# EAGLE schematic Xbee_Adapter (EAGLE 7.5.0)
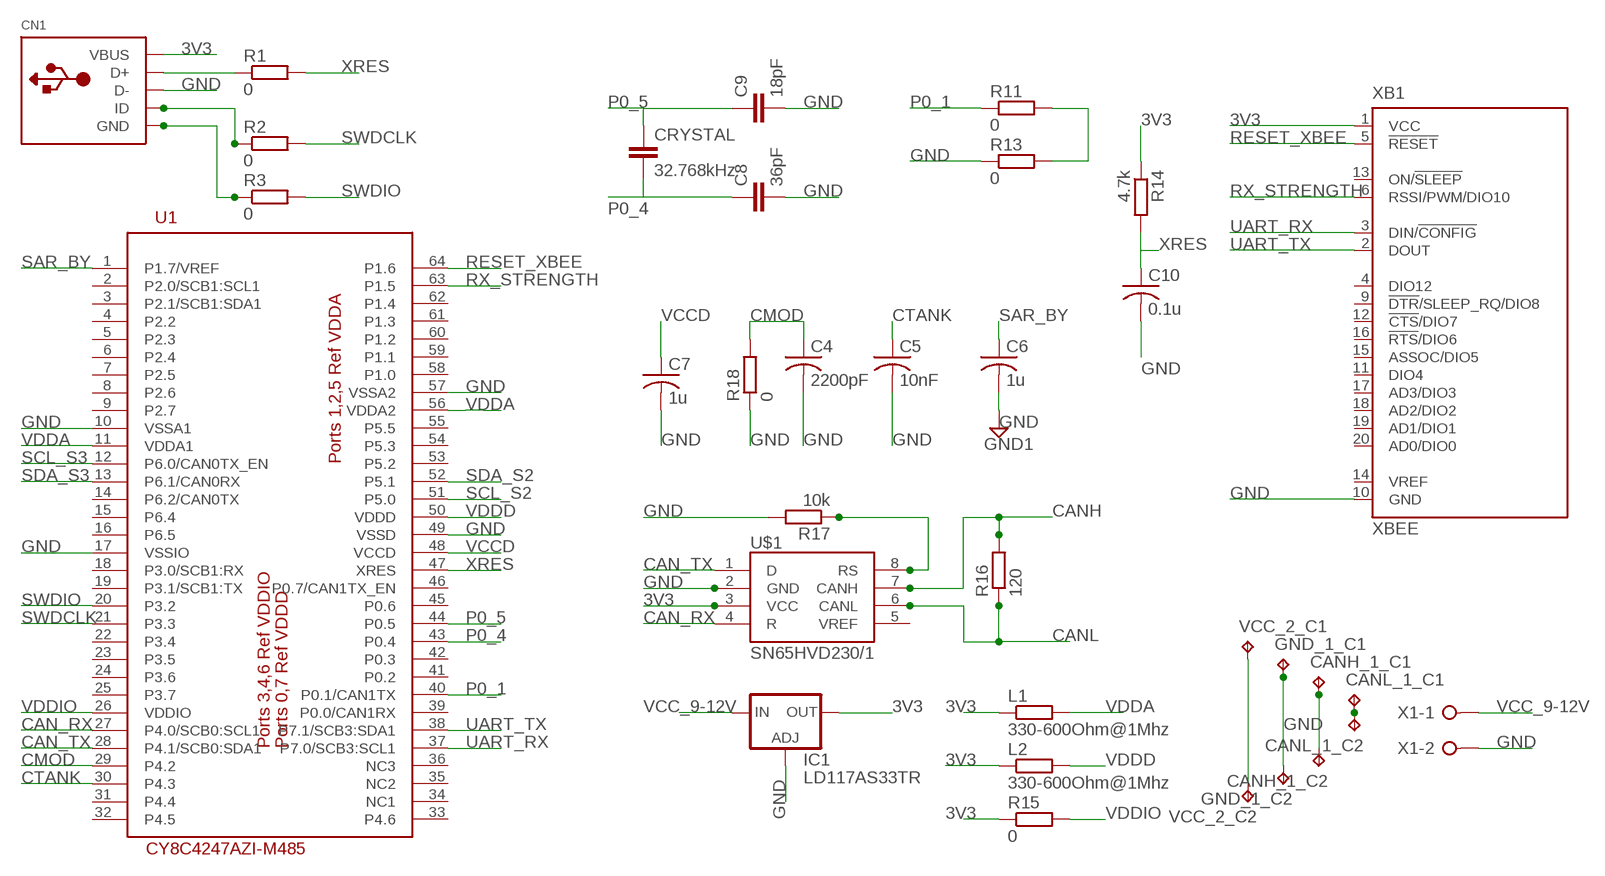
[diagram p0: schematic, sheet 1]

## Parts
C4  2200pF  C-USC0805  [C0805]
C5  10nF  C-USC0805  [C0805]
C6  1u  C-USC0805  [C0805]
C7  1u  C-USC0805  [C0805]
C8  36pF  C-EUC0805  [C0805]
C9  18pF  C-EUC0805  [C0805]
C10  0.1u  C-USC0805  [C0805]
CANH_1_C1  TPB2,54  [B2,54]
CANH_1_C2  TPB2,54  [B2,54]
CANL_1_C1  TPB2,54  [B2,54]
CANL_1_C2  TPB2,54  [B2,54]
CN1  USBMINIB  [USB-MINIB]
CRYSTAL  32.768kHz  C-EUC0603  [C0603]
GND_1_C1  TPB2,54  [B2,54]
GND_1_C2  TPB2,54  [B2,54]
IC1  LD117AS33TR  [SOT223]
L1  330-600Ohm@1Mhz  R-EU_R0805  [R0805]
L2  330-600Ohm@1Mhz  R-EU_R0805  [R0805]
R1  0  R-EU_R0805  [R0805]
R2  0  R-EU_R0805  [R0805]
R3  0  R-EU_R0805  [R0805]
R11  0  R-EU_R0805  [R0805]
R13  0  R-EU_R0805  [R0805]
R14  4.7k  R-EU_R0805  [R0805]
R15  0  R-EU_R0805  [R0805]
R16  120  R-EU_R0805  [R0805]
R17  10k  R-EU_R0805  [R0805]
R18  0  R-EU_R0805  [R0805]
U1  CY8C4247AZI-M485  [TQFP64-10X10]
U$1  SN65HVD230/1  [SO8]
VCC_2_C1  TPB2,54  [B2,54]
VCC_2_C2  TPB2,54  [B2,54]
X1  W237-02P  [W237-132]
XB1  XBEE  [XBEE]

## Nets
3V3: CN1.VBUS IC1.4(OUT) L1.1 L2.1 R14.1 R15.1 U$1.3(VCC) XB1.1(VCC)
CAN_RX: U1.27(P4.0/SCB0:SCL1) U$1.4(R)
CAN_TX: U1.28(P4.1/SCB0:SDA1) U$1.1(D)
CANH: CANH_1_C1.TP CANH_1_C2.TP R16.2 U$1.7(CANH)
CANL: CANL_1_C1.TP CANL_1_C2.TP R16.1 U$1.6(CANL)
CMOD: C4.1 R18.2 U1.29(P4.2)
CTANK: C5.1 U1.30(P4.3)
GND: C4.2 C5.2 C6.2 C7.2 C8.2 C9.2 C10.2 CN1.D- GND_1_C1.TP GND_1_C2.TP IC1.1(ADJ) R13.1 R17.2 R18.1 U1.10(VSSA1) U1.17(VSSIO) U1.49(VSSD) U1.57(VSSA2) U$1.2(GND) X1.2 XB1.10(GND) ; supply symbol labelled GND1
N$1: CN1.D+ R1.1
N$2: CN1.ID R2.1
N$3: CN1.GND R3.1
N$4: R11.2 R13.2
N$9: R17.1 U$1.8(RS)
P0_1: R11.1 U1.40(P0.1/CAN1TX)
P0_4: C8.1 CRYSTAL.2 U1.43(P0.4)
P0_5: C9.1 CRYSTAL.1 U1.44(P0.5)
RESET_XBEE: U1.64(P1.6) XB1.5(!RESET)
RX_STRENGTH: U1.63(P1.5) XB1.6(RSSI/PWM/DIO10)
SAR_BY: C6.1 U1.1(P1.7/VREF)
SCL_S2: U1.51(P5.0)
SCL_S3: U1.12(P6.0/CAN0TX_EN)
SDA_S2: U1.52(P5.1)
SDA_S3: U1.13(P6.1/CAN0RX)
SWDCLK: R2.2 U1.21(P3.3)
SWDIO: R3.2 U1.20(P3.2)
UART_RX: U1.37(P7.0/SCB3:SCL1) XB1.3(DIN/!CONFIG)
UART_TX: U1.38(P7.1/SCB3:SDA1) XB1.2(DOUT)
VCC_9-12V: IC1.3(IN) VCC_2_C1.TP VCC_2_C2.TP X1.1
VCCD: C7.1 U1.48(VCCD)
VDDA: L1.2 U1.11(VDDA1) U1.56(VDDA2)
VDDD: L2.2 U1.50(VDDD)
VDDIO: R15.2 U1.26(VDDIO)
XRES: C10.1 R1.2 R14.2 U1.47(XRES)
Unconnected: U1.2(P2.0/SCB1:SCL1) U1.3(P2.1/SCB1:SDA1) U1.4(P2.2) U1.5(P2.3) U1.6(P2.4) U1.7(P2.5) U1.8(P2.6) U1.9(P2.7) U1.14(P6.2/CAN0TX) U1.15(P6.4) U1.16(P6.5) U1.18(P3.0/SCB1:RX) U1.19(P3.1/SCB1:TX) U1.22(P3.4) U1.23(P3.5) U1.24(P3.6) U1.25(P3.7) U1.31(P4.4) U1.32(P4.5) U1.33(P4.6) U1.34(NC1) U1.35(NC2) U1.36(NC3) U1.39(P0.0/CAN1RX) U1.41(P0.2) U1.42(P0.3) U1.45(P0.6) U1.46(P0.7/CAN1TX_EN) U1.53(P5.2) U1.54(P5.3) U1.55(P5.5) U1.58(P1.0) U1.59(P1.1) U1.60(P1.2) U1.61(P1.3) U1.62(P1.4) U$1.5(VREF) XB1.4(DIO12) XB1.9(!DTR!/SLEEP_RQ/DIO8) XB1.11(DIO4) XB1.12(!CTS!/DIO7) XB1.13(ON/!SLEEP) XB1.14(VREF) XB1.15(ASSOC/DIO5) XB1.16(!RTS!/DIO6) XB1.17(AD3/DIO3) XB1.18(AD2/DIO2) XB1.19(AD1/DIO1) XB1.20(AD0/DIO0)

## Library data of the parts
C4-C7 C10 = rcl:C-US: CAPACITOR, American symbol
C8 C9 CRYSTAL = rcl:C-EU: CAPACITOR, European symbol
CANH_1_C1 CANH_1_C2 CANL_1_C1 CANL_1_C2 GND_1_C1 GND_1_C2 VCC_2_C1 VCC_2_C2 = testpad:TP: Test pad
CN1 = adafruit:USB: USB Connectors USBMINIB - Surface Mount Female Mini-B USB Connector 4UConnector: 06564 By microbuilder.eu Thru-hole RA Female Mini-B USB Connector 4UConnector: 18732 By ladyada.net
IC1 = v-reg:LD117A?*: Low drop fixed and adjustable positive voltage regulators 1 A Source: http://www.st.com/stonline/products/literature/ds/7194/ld1117axx.pdf
L1 L2 R1-R3 R11 R13-R18 = rcl:R-EU_: RESISTOR, European symbol
U1 = CypressPSoC:CY8C4247AZI-M485
U$1 = texas_instruments:SN65HVD230/1
X1 = con-wago-508:W237-02P: WAGO SREW CLAMP; OC_FARNELL: unknown; OC_NEWARK: unknown
XB1 = xbee:XBEE: XBee (TM) /XBee-PRO(TM) OEM RF Modules Source: MaxStream, Inc. xbee_productmanual.pdf; MPN: XBP24-Z7UIT-004; OC_FARNELL: 1751799; OC_NEWARK: 34R5507